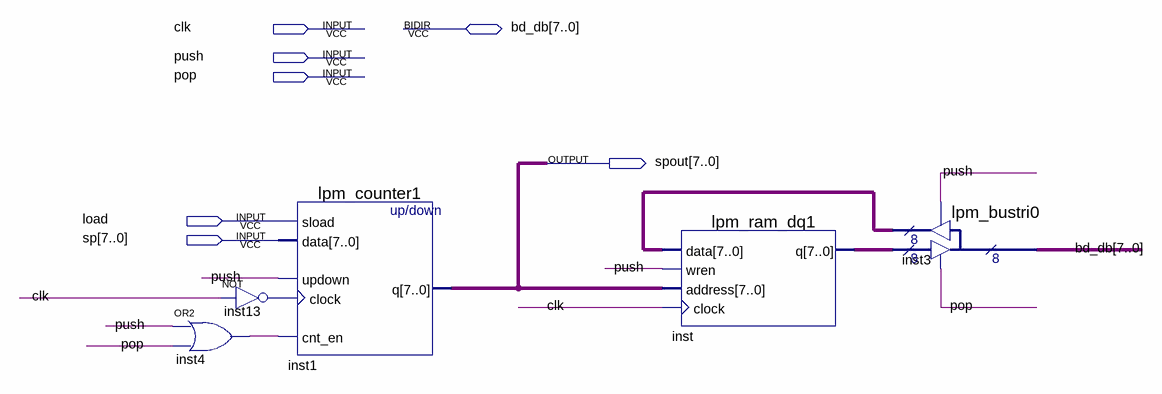
[diagram p0: schematic sheet]
// Quartus schematic WN_stack.bdf as structural Verilog: 5 symbols, 7 pins
module WN_stack (
  input  clk,
  input  push,
  input  pop,
  input  load,
  input  [7:0] sp,
  inout  [7:0] bd_db,
  output [7:0] spout
);

  wire inst4_out, inst13_out;
  wire [7:0] inst3_result, inst_q;

  not inst13 (inst13_out, clk);
  or inst4 (inst4_out, push, pop);
  lpm_counter1 inst1 (.sload(load), .data(sp), .updown(push), .clock(inst13_out), .cnt_en(inst4_out), .q(spout));
  lpm_ram_dq1 inst (.data(inst3_result), .wren(push), .address(spout), .clock(clk), .q(inst_q));
  lpm_bustri0 inst3 (.enabledt(pop), .data(inst_q), .enabletr(push), .result(inst3_result), .tridata(bd_db));
endmodule
